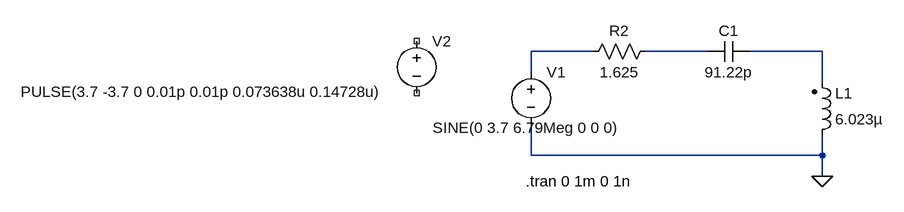
[diagram p0: schematic LRC.asc]
LRC.asc, the LTspice schematic file:
Version 4
SHEET 1 2368 796
WIRE 32 112 -64 112
WIRE 208 112 112 112
WIRE 384 112 272 112
WIRE -64 144 -64 112
WIRE 384 160 384 112
WIRE -64 272 -64 224
WIRE 384 272 384 240
WIRE 384 272 -64 272
WIRE 384 304 384 272
FLAG 384 304 0
SYMBOL voltage -64 128 R0
WINDOW 123 0 0 Left 0
WINDOW 39 0 0 Left 0
WINDOW 3 -151 101 Left 2
SYMATTR Value SINE(0 3.7 6.79Meg 0 0 0)
SYMATTR InstName V1
SYMBOL cap 272 96 R90
WINDOW 0 0 32 VBottom 2
WINDOW 3 32 32 VTop 2
SYMATTR InstName C1
SYMATTR Value 91.22p
SYMBOL ind2 368 256 M180
WINDOW 0 36 80 Left 2
WINDOW 3 36 40 Left 2
SYMATTR InstName L1
SYMATTR Value 6.023µ
SYMATTR Type ind
SYMBOL res 128 96 R90
WINDOW 0 0 56 VBottom 2
WINDOW 3 32 56 VTop 2
SYMATTR InstName R2
SYMATTR Value 1.625
SYMBOL voltage -240 80 R0
WINDOW 123 0 0 Left 0
WINDOW 39 0 0 Left 0
WINDOW 3 -609 94 Left 2
SYMATTR Value PULSE(3.7 -3.7 0 0.01p 0.01p 0.073638u 0.14728u)
SYMATTR InstName V2
TEXT -72 312 Left 2 !.tran 0 1m 0 1n

The netlist it stands for:
* LRC.asc
V1 N001 0 SINE(0 3.7 6.79Meg 0 0 0)
C1 N003 N002 91.22p
L1 0 N003 6.023µ
R2 N002 N001 1.625
V2 NC_01 NC_02 PULSE(3.7 -3.7 0 0.01p 0.01p 0.073638u 0.14728u)
.tran 0 1m 0 1n
.backanno
.end